# Altium project 12345.PrjPcb
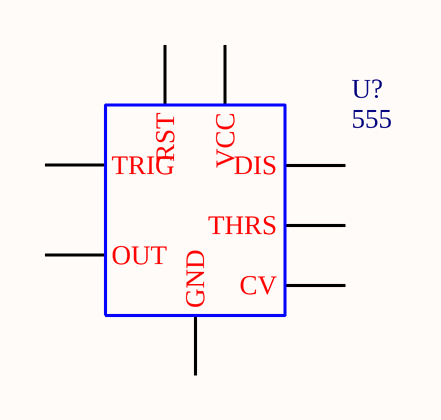
[diagram p0: 12345.SchDoc]
1 sheet, 1 parts. Net scope: global (net labels, ports and power ports of the same name join across sheets).
Board file: 12345.PcbDoc

## Sheet 12345.SchDoc
size A; SheetNumber: 1; SheetTotal: 1

### Parts
U?  555

### Nets

Not connected (* = marked no-connect by the designer): U? 1(GND) 2(TRIG) 3(OUT) 4(RST) 5(CV) 6(THRS) 7(DIS) 8(VCC)

### Library data of the parts
U? = 555: Timer 555; SimulationGenericComponent: True